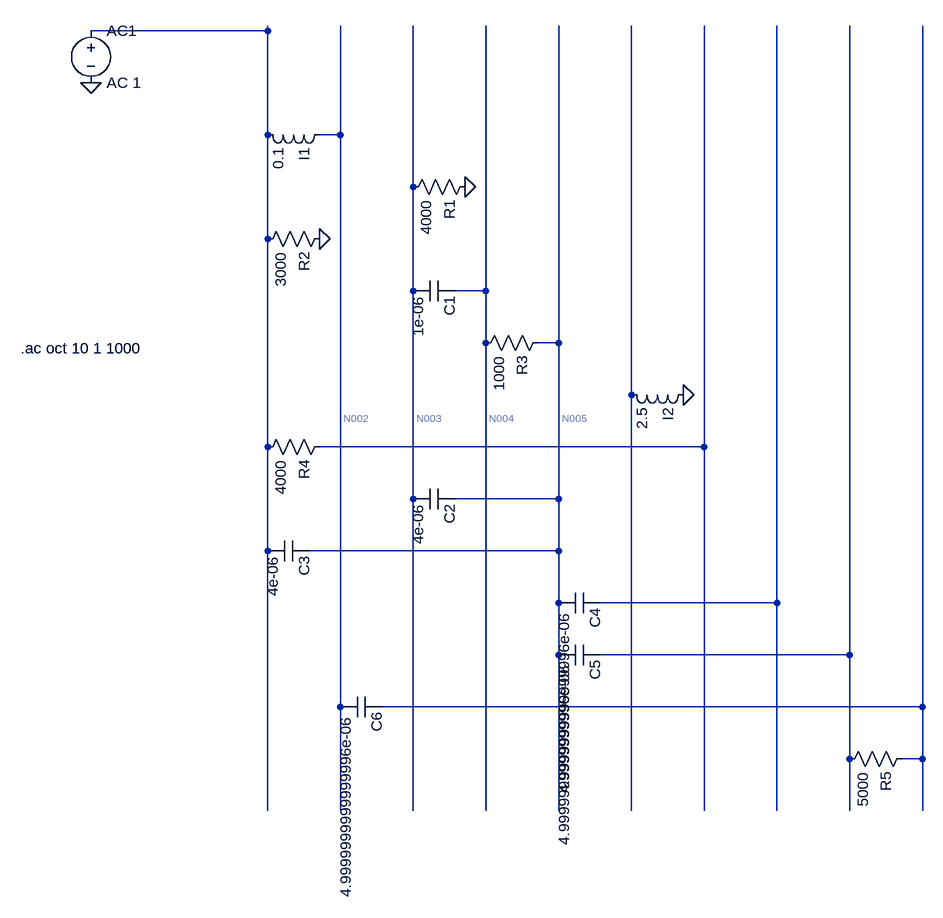
[diagram p0: schematic ckt_0G_1Vin.asc]
ckt_0G_1Vin.asc, the LTspice schematic file:
Version 4
SHEET 1 880 680
SYMBOL voltage -272 -176 R0
WINDOW 123 0 0 Left 0
WINDOW 39 0 0 Left 0
SYMATTR InstName AC1
SYMATTR Value AC 1
FLAG -272 -80 0
WIRE 0 -160 -272 -160
TEXT -380 328 Left 2 !.ac oct 10 1 1000
WIRE 0 -168 0 1040
WIRE 112 -168 112 1040
WIRE 224 -168 224 1040
WIRE 336 -168 336 1040
WIRE 448 -168 448 1040
WIRE 560 -168 560 1040
WIRE 672 -168 672 1040
WIRE 784 -168 784 1040
WIRE 896 -168 896 1040
WIRE 1008 -168 1008 1040
SYMBOL ind 96 -16 R90
SYMATTR InstName I1
SYMATTR Value 0.1
SYMBOL res 320 64 R90
SYMATTR InstName R1
SYMATTR Value 4000
SYMBOL res 96 144 R90
SYMATTR InstName R2
SYMATTR Value 3000
SYMBOL cap 288 224 R90
SYMATTR InstName C1
SYMATTR Value 1e-06
SYMBOL res 432 304 R90
SYMATTR InstName R3
SYMATTR Value 1000
SYMBOL ind 656 384 R90
SYMATTR InstName I2
SYMATTR Value 2.5
SYMBOL res 96 464 R90
SYMATTR InstName R4
SYMATTR Value 4000
SYMBOL cap 288 544 R90
SYMATTR InstName C2
SYMATTR Value 4e-06
SYMBOL cap 64 624 R90
SYMATTR InstName C3
SYMATTR Value 4e-06
SYMBOL cap 512 704 R90
SYMATTR InstName C4
SYMATTR Value 4.9999999999999996e-06
SYMBOL cap 512 784 R90
SYMATTR InstName C5
SYMATTR Value 4.9999999999999996e-06
SYMBOL cap 176 864 R90
SYMATTR InstName C6
SYMATTR Value 4.9999999999999996e-06
SYMBOL res 992 944 R90
SYMATTR InstName R5
SYMATTR Value 5000
WIRE 80 0 112 0
WIRE 288 240 336 240
WIRE 416 320 448 320
WIRE 80 480 672 480
WIRE 288 560 448 560
WIRE 64 640 448 640
WIRE 512 720 784 720
WIRE 512 800 896 800
WIRE 176 880 1008 880
WIRE 976 960 1008 960
FLAG 304 80 0
FLAG 80 160 0
FLAG 640 400 0

The netlist it stands for:
* ckt_0G_1Vin.asc
V§AC1 N001 0 AC 1
L§I1 N002 N001 0.1
R1 0 N003 4000
R2 0 N001 3000
C1 N004 N003 1e-06
R3 N005 N004 1000
L§I2 0 N006 2.5
R4 N007 N001 4000
C2 N005 N003 4e-06
C3 N005 N001 4e-06
C4 N008 N005 4.9999999999999996e-06
C5 N009 N005 4.9999999999999996e-06
C6 N010 N002 4.9999999999999996e-06
R5 N010 N009 5000
.ac oct 10 1 1000
.backanno
.end

* Results of the author's LTspice run, read from the files saved beside the schematic
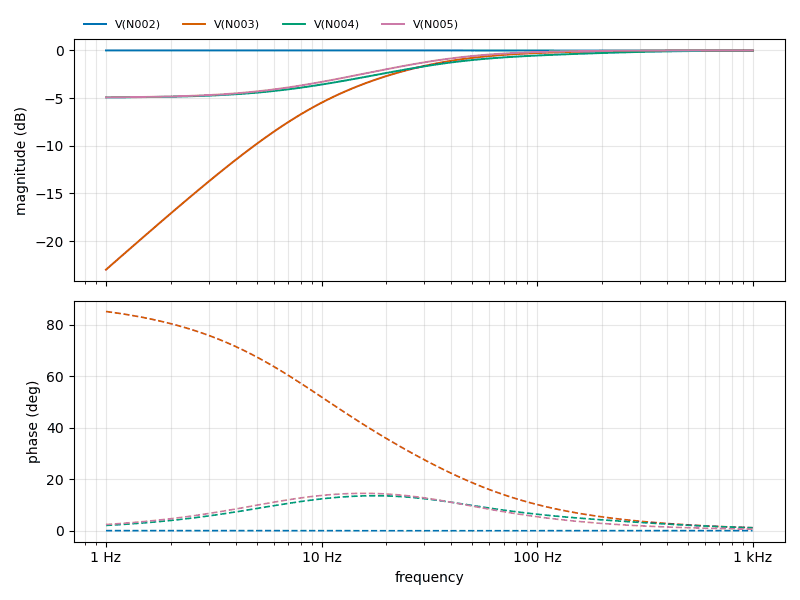
[diagram p1: AC Analysis of ckt_0G_1Vin.asc, plotted from the saved traces]
* AC Analysis, 1 run:
*   V(N002): 0.00 dB at 1 Hz, -0.01 dB at 1 kHz, peak 0.00 dB at 9.19 Hz
*   V(N003): -23.01 dB at 1 Hz, -0.01 dB at 1 kHz, peak -0.01 dB at 1 kHz, 3 dB below the peak at 18.08 Hz
*   V(N004): -4.93 dB at 1 Hz, -0.02 dB at 1 kHz, peak -0.02 dB at 1 kHz, 3 dB below the peak at 13.87 Hz
*   V(N005): -4.92 dB at 1 Hz, -0.00 dB at 1 kHz, peak -0.00 dB at 1 kHz, 3 dB below the peak at 11.71 Hz